# EAGLE schematic 19260 (EAGLE 7.6.0)

## Sheet 1 of 2
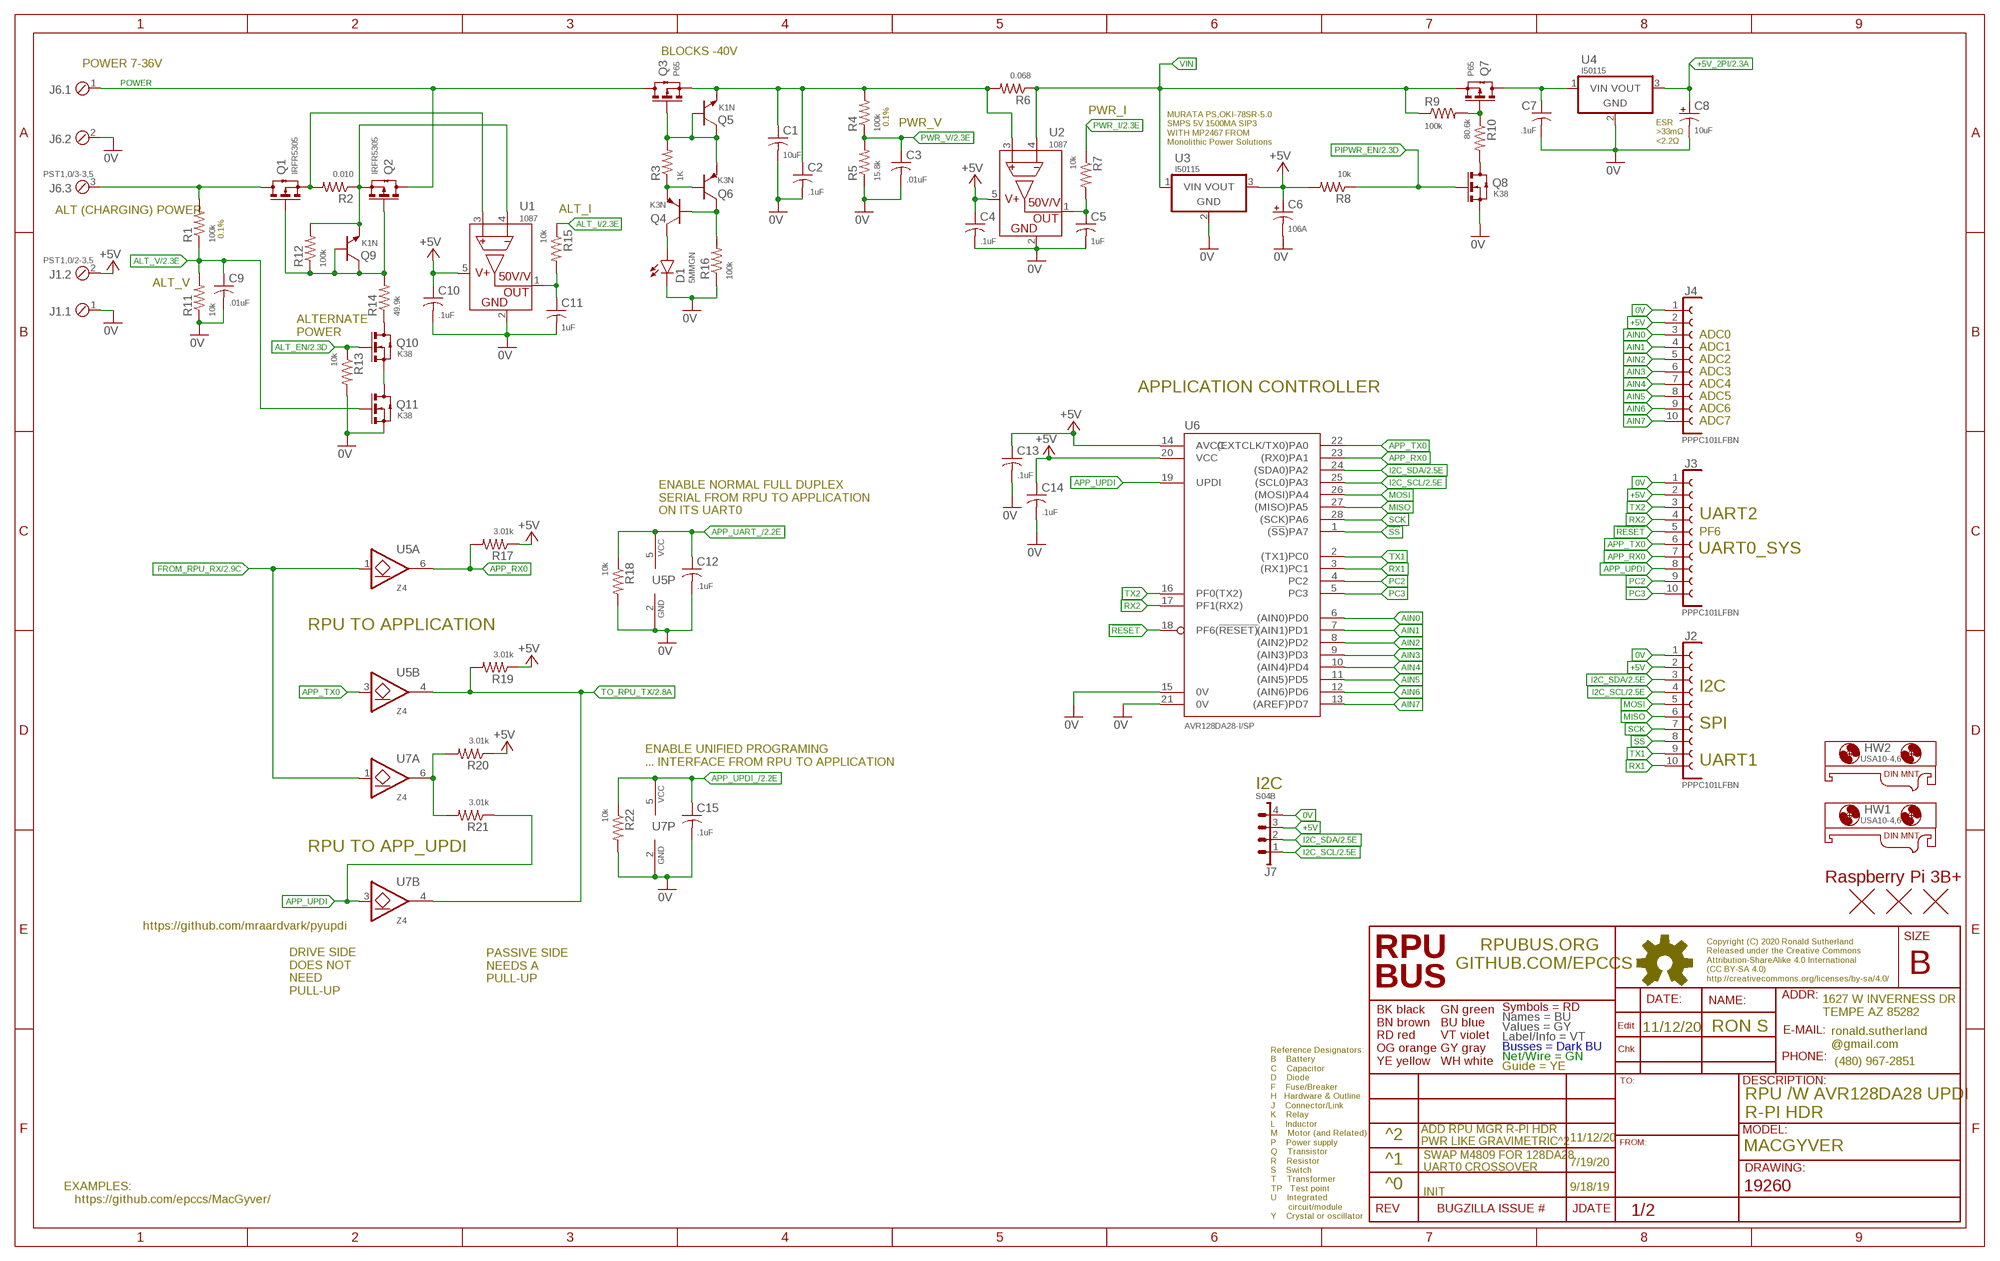
[diagram p0: schematic, sheet 1]

### Parts
C1  10uF  CC1206  [C1206(3216)]
C2  .1uF  CC0805A  [C0805(2012)]
C3  .01uF  CC0603A  [C0603(1608)]
C4  .1uF  CC0603A  [C0603(1608)]
C5  1uF  CC0805A  [C0805(2012)]
C6  106A  CT1206  [3216]
C7  .1uF  CC0603A  [C0603(1608)]
C8  10uF  CT1206  [3216]
C9  .01uF  CC0603A  [C0603(1608)]
C10  .1uF  CC0603A  [C0603(1608)]
C11  1uF  CC0805A  [C0805(2012)]
C12  .1uF  CC0603A  [C0603(1608)]
C13  .1uF  CC0603A  [C0603(1608)]
C14  .1uF  CC0603A  [C0603(1608)]
C15  .1uF  CC0603A  [C0603(1608)]
D1  5MMGN  LED5MM  [LED5MM]
HW1  USA10-4,6  MOUNT-HOLE5.0  [USA10]
HW2  USA10-4,6  MOUNT-HOLE5.0  [USA10]
J1  PST1,0/2-3,5  MCV2  [MCV2]
J2  PPPC101LFBN  F1X10  [F1X10]
J3  PPPC101LFBN  F1X10  [F1X10]
J4  PPPC101LFBN  F1X10  [F1X10]
J6  PST1,0/3-3,5  MCV3  [MCV3]
J7  S04B  B04B  [B04B]
Q1  IRFR5305  N-CHDPAK  [DPAK]
Q2  IRFR5305  N-CHDPAK  [DPAK]
Q3  P65  N-CHSOT23  [SOT23]
Q4  K3N  PNPSOT23  [SOT23]
Q5  K1N  NPNSOT23  [SOT23]
Q6  K3N  PNPSOT23  [SOT23]
Q7  P65  N-CHSOT23  [SOT23]
Q8  K38  N-CHSOT23  [SOT23]
Q9  K1N  NPNSOT23  [SOT23]
Q10  K38  N-CHSOT23  [SOT23]
Q11  K38  N-CHSOT23  [SOT23]
R1  100k  R0805  [C0805(2012)]
R2  0.010  R1210  [C1210(3225)]
R3  1K  R0805  [C0805(2012)]
R4  100k  R0805  [C0805(2012)]
R5  15.8k  R0805  [C0805(2012)]
R6  0.068  R1210  [C1210(3225)]
R7  10k  R0805  [C0805(2012)]
R8  10k  R0805  [C0805(2012)]
R9  100k  R0805  [C0805(2012)]
R10  80.6k  R0805  [C0805(2012)]
R11  10k  R0805  [C0805(2012)]
R12  100k  R0805  [C0805(2012)]
R13  10k  R0805  [C0805(2012)]
R14  49.9k  R0805  [C0805(2012)]
R15  10k  R0805  [C0805(2012)]
R16  100k  R0805  [C0805(2012)]
R17  3.01k  R0805  [C0805(2012)]
R18  10k  R0805  [C0805(2012)]
R19  3.01k  R0805  [C0805(2012)]
R20  3.01k  R0805  [C0805(2012)]
R21  3.01k  R0805  [C0805(2012)]
R22  10k  R0805  [C0805(2012)]
U1  1087  ZXCT1087  [SOT23-5]
U2  1087  ZXCT1087  [SOT23-5]
U3  I50115  OKI-78SR-H  [OKI-78SR-H]
U4  I50115  OKI-78SR-H  [OKI-78SR-H]
U5  Z4  2G07SOT26  [SOT23-6,SOT26]
U6  AVR128DA28-I/SP  [DIL28-3]
U7  Z4  2G07SOT26  [SOT23-6,SOT26]
U$1  R-PI3B+  [R-PI3B+]
U$2  FIDUCIAL1.27  [FIDUCIAL-1.27]
U$3  FIDUCIAL1.27  [FIDUCIAL-1.27]
U$4  FIDUCIAL1.27  [FIDUCIAL-1.27]

### Nets
0V: C1.2 C2.2 C3.2 C4.2 C5.2 C6.- C7.2 C8.- C9.2 C10.2 C11.2 C12.2 C13.2 C14.2 C15.2 D1.K J1.1 J2.1 J3.1 J4.1 J6.2 J7.4 Q8.2(S)(S) Q11.2(S)(S) R5.1 R11.1 R13.2 R16.1 R18.2 R22.2 U1.2(GND) U2.2(GND) U3.2(GND) U4.2(GND) U5.2(P:GND) U6.15(0V) U6.21(0V) U7.2(P:GND) ; also sheet 2
!RESET: J3.5 U6.18(PF6(!RESET))
!SS: J2.8 U6.1((!SS!)PA7)
+5V: C4.1 C6.+ C10.1 C13.1 C14.1 J1.2 J2.2 J3.2 J4.2 J7.3 R8.2 R17.1 R19.1 R20.1 U1.5(VCC) U2.5(VCC) U3.3(VOUT) U6.14(AVCC) U6.20(VCC) ; also sheet 2
+5V_2PI: C8.+ U4.3(VOUT) ; also sheet 2
AIN0: J4.3 U6.6((AIN0)PD0)
AIN1: J4.4 U6.7((AIN1)PD1)
AIN2: J4.5 U6.8((AIN2)PD2)
AIN3: J4.6 U6.9((AIN3)PD3)
AIN4: J4.7 U6.10((AIN4)PD4)
AIN5: J4.8 U6.11((AIN5)PD5)
AIN6: J4.9 U6.12((AIN6)PD6)
AIN7: J4.10 U6.13((AREF)PD7)
ALT_EN: Q10.1(G)(G) R13.1 ; also sheet 2
ALT_I: R15.1 ; also sheet 2
ALT_V: C9.1 Q11.1(G)(G) R1.1 R11.2 ; also sheet 2
APP_RX0: J3.7 R17.2 U5.6(A:O) U6.23((RX0)PA1)
APP_TX0: J3.6 U5.3(B:I) U6.22((EXTCLK/TX0)PA0)
APP_UART_: C12.1 R18.1 U5.5(P:VCC) ; also sheet 2
APP_UPDI: J3.8 R21.1 U6.19(UPDI) U7.3(B:I)
APP_UPDI_: C15.1 R22.1 U7.5(P:VCC) ; also sheet 2
APP_UPDI_PULLUP: R20.2 R21.2 U7.6(A:O)
FROM_RPU_RX: U5.1(A:I) U7.1(A:I) ; also sheet 2
I2C_SCL: J2.4 J7.1 U6.25((SCL0)PA3) ; also sheet 2
I2C_SDA: J2.3 J7.2 U6.24((SDA0)PA2) ; also sheet 2
MISO: J2.6 U6.27((MISO)PA5)
MOSI: J2.5 U6.26((MOSI)PA4)
N$2: Q7.1(G)(G) R9.2 R10.1
N$4: Q8.3(D)(D) R10.2
N$5: Q4.B Q6.C R16.2
N$6: Q3.1(G)(G) Q5.B Q5.C Q6.E R3.2
N$7: D1.A Q4.C
N$8: C5.1 R7.2 U2.1(OUT)
N$10: Q4.E Q6.B R3.1
N$31: J6.3 Q1.SINK(D) R1.2
N$32: Q2.3(S) Q9.E R2.1 R12.2 U1.4(S-)
N$33: Q1.1(G) Q2.1(G) Q9.B Q9.C R12.1 R14.2
N$34: Q10.3(D)(D) R14.1
N$65: C11.1 R15.2 U1.1(OUT)
N$66: Q1.3(S) R2.2 U1.3(S+)
N$97: Q10.2(S)(S) Q11.3(D)(D)
PC2: J3.9 U6.4(PC2)
PC3: J3.10 U6.5(PC3)
PIPWR_EN: Q8.1(G)(G) R8.1 ; also sheet 2
POWER: J6.1 Q2.SINK(D) Q3.3(D)(D)
PWR_I: R7.1 ; also sheet 2
PWR_V: C3.1 R4.1 R5.2 ; also sheet 2
RX1: J2.10 U6.3((RX1)PC1)
RX2: J3.4 U6.17(PF1(RX2))
SCK: J2.7 U6.28((SCK)PA6)
SHLD_VIN: C7.1 Q7.3(D)(D) U4.1(VIN)
TO_RPU_TX: R19.2 U5.4(B:O) U7.4(B:O) ; also sheet 2
TX1: J2.9 U6.2((TX1)PC0)
TX2: J3.3 U6.16(PF0(TX2))
VIN: Q7.2(S)(S) R6.1 R9.1 U2.4(S-) U3.1(VIN)
VIN_S: C1.1 C2.1 Q3.2(S)(S) Q5.E R4.2 R6.2 U2.3(S+)

### Notes on the sheet
- BLOCKS -40V
- POWER 7-36V
- PWR_I
- 0.1% | PWR_V
- ESR
  >33mΩ
  <2.2Ω
- MURATA PS,OKI-78SR-5.0
  SMPS 5V 1500MA SIP3
  WITH MP2467 FROM 
  Monolithic Power Solutions
- ALT (CHARGING) POWER | ALT_I
- 0.1%
- ALT_V
- ALTERNATE
  POWER
- ADC0
- ADC1
- ADC2
- ADC3
- ADC4
- APPLICATION CONTROLLER
- ADC5
- ADC6
- ADC7
- ENABLE NORMAL FULL DUPLEX 
  SERIAL FROM RPU TO APPLICATION
  ON ITS UART0
- UART2
- PF6
- UART0_SYS
- RPU TO APPLICATION
- I2C
- SPI
- ENABLE UNIFIED PROGRAMING
  ... INTERFACE FROM RPU TO APPLICATION
- UART1
- I2C
- RPU TO APP_UPDI
- https://github.com/mraardvark/pyupdi
- PASSIVE SIDE
  NEEDS A
  PULL-UP
- DRIVE SIDE
  DOES NOT
  NEED 
  PULL-UP
- 11/12/20 | RON S
- RPU /W AVR128DA28 UPDI
  R-PI HDR
- ^2 | 11/12/20
- ADD RPU MGR R-PI HDR
  PWR LIKE GRAVIMETRIC^2
- MACGYVER
- ^1 | 7/19/20
- SWAP M4809 FOR 128DA28
  UART0 CROSSOVER
- ^0 | 9/18/19
- INIT
- EXAMPLES:
     https://github.com/epccs/MacGyver/

## Sheet 2 of 2
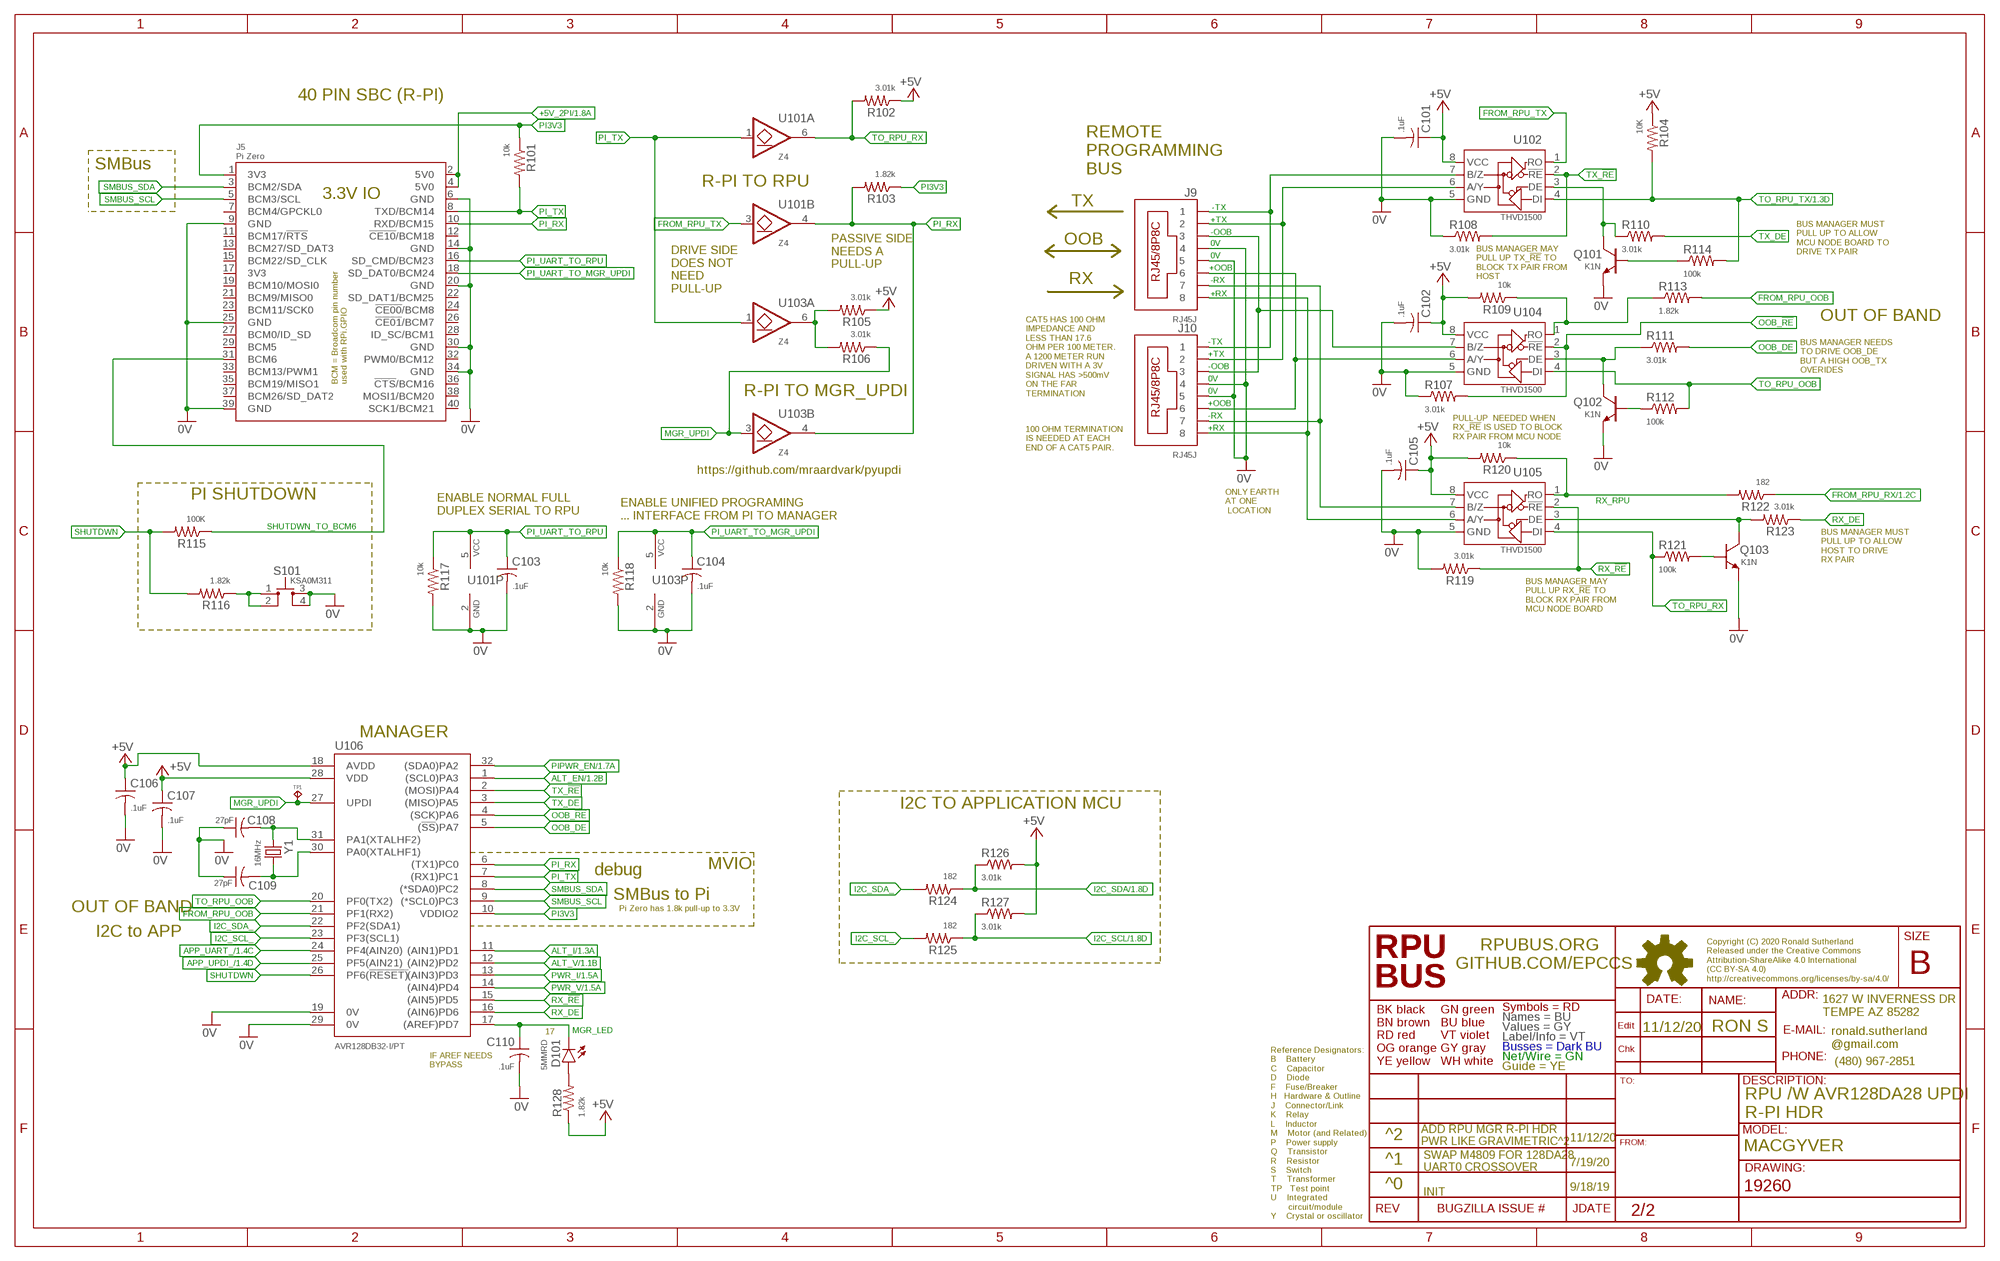
[diagram p1: schematic, sheet 2]

### Parts
C101  .1uF  CC0603A  [C0603(1608)]
C102  .1uF  CC0603A  [C0603(1608)]
C103  .1uF  CC0603A  [C0603(1608)]
C104  .1uF  CC0603A  [C0603(1608)]
C105  .1uF  CC0603A  [C0603(1608)]
C106  .1uF  CC0603A  [C0603(1608)]
C107  .1uF  CC0603A  [C0603(1608)]
C108  27pF  CC0603A  [C0603(1608)]
C109  27pF  CC0603A  [C0603(1608)]
C110  .1uF  CC0603A  [C0603(1608)]
D101  5MMRD  LED5MM  [LED5MM]
J5  Pi Zero  RPI-ZERO90  [RASPI_ZERO_V40PIN]
J9  RJ45J  RJ45-8HZT  [RJ45-8HZT]
J10  RJ45J  RJ45-8HZT  [RJ45-8HZT]
Q101  K1N  NPNSOT23  [SOT23]
Q102  K1N  NPNSOT23  [SOT23]
Q103  K1N  NPNSOT23  [SOT23]
R101  10k  R0805  [C0805(2012)]
R102  3.01k  R0805  [C0805(2012)]
R103  1.82k  R0805  [C0805(2012)]
R104  10K  R0805  [C0805(2012)]
R105  3.01k  R0805  [C0805(2012)]
R106  3.01k  R0805  [C0805(2012)]
R107  3.01k  R0805  [C0805(2012)]
R108  3.01k  R0805  [C0805(2012)]
R109  10k  R0805  [C0805(2012)]
R110  3.01k  R0805  [C0805(2012)]
R111  3.01k  R0805  [C0805(2012)]
R112  100k  R0805  [C0805(2012)]
R113  1.82k  R0805  [C0805(2012)]
R114  100k  R0805  [C0805(2012)]
R115  100K  R0805  [C0805(2012)]
R116  1.82k  R0805  [C0805(2012)]
R117  10k  R0805  [C0805(2012)]
R118  10k  R0805  [C0805(2012)]
R119  3.01k  R0805  [C0805(2012)]
R120  10k  R0805  [C0805(2012)]
R121  100k  R0805  [C0805(2012)]
R122  182  R0805  [C0805(2012)]
R123  3.01k  R0805  [C0805(2012)]
R124  182  R0805  [C0805(2012)]
R125  182  R0805  [C0805(2012)]
R126  3.01k  R0805  [C0805(2012)]
R127  3.01k  R0805  [C0805(2012)]
R128  1.82k  R0805  [C0805(2012)]
S101  KSA0M311  [0M311]
TP1  TPPAD1-08  [P1-08]
U101  Z4  2G07SOT26  [SOT23-6,SOT26]
U102  THVD1500  ISL3172EIBZ  [SOIC8]
U103  Z4  2G07SOT26  [SOT23-6,SOT26]
U104  THVD1500  ISL3172EIBZ  [SOIC8]
U105  THVD1500  ISL3172EIBZ  [SOIC8]
U106  AVR128DB32-I/PT  AVR128DB32  [TQFP32-08]
Y1  16MHz  CSM-3X  [CSM-3X]

### Nets
0V: C101.2 C102.2 C103.2 C104.2 C105.2 C106.2 C107.2 C108.1 C109.1 C110.2 J5.6(GND) J5.9(GND) J5.14(GND) J5.20(GND) J5.25(GND) J5.30(GND) J5.34(GND) J5.39(GND) J9.4 J9.5 J10.4 J10.5 Q101.E Q102.E Q103.E R107.1 R108.1 R117.2 R118.2 R119.2 S101.3 S101.4 U101.2(P:GND) U102.5(GND) U103.2(P:GND) U104.5(GND) U105.5(GND) U106.19(0V) U106.29(0V) ; also sheet 1
+5V: C101.1 C102.1 C105.1 C106.1 C107.1 R102.1 R104.1 R105.1 R109.2 R120.2 R126.2 R127.2 R128.1 U102.8(VCC) U104.8(VCC) U105.8(VCC) U106.18(AVDD) U106.28(VDD) ; also sheet 1
+5V_2PI: J5.2(5V0) J5.4(5V0) ; also sheet 1
+OOB: J9.6 J10.6 U104.6(A/Y)
+RX: J9.8 J10.8 U105.6(A/Y)
+TX: J9.2 J10.2 U102.6(A/Y)
-OOB: J9.3 J10.3 U104.7(B/Z)
-RX: J9.7 J10.7 U105.7(B/Z)
-TX: J9.1 J10.1 U102.7(B/Z)
ALT_EN: U106.1((SCL0)PA3) ; also sheet 1
ALT_I: U106.11((AIN1)PD1) ; also sheet 1
ALT_V: U106.12((AIN2)PD2) ; also sheet 1
APP_UART_: U106.24(PF4(AIN20)) ; also sheet 1
APP_UPDI_: U106.25(PF5(AIN21)) ; also sheet 1
FROM_RPU_OOB: R113.2 U106.21(PF1(RX2))
FROM_RPU_RX: R122.1 ; also sheet 1
FROM_RPU_TX: U101.3(B:I) U102.1(RO)
I2C_SCL: R125.1 R127.1 ; also sheet 1
I2C_SCL_: R125.2 U106.23(PF3(SCL1))
I2C_SDA: R124.1 R126.1 ; also sheet 1
I2C_SDA_: R124.2 U106.22(PF2(SDA1))
MGR_LED: C110.1 D101.K U106.17((AREF)PD7)
MGR_UPDI: R106.1 TP1.TP U103.3(B:I) U106.27(UPDI)
MGR_UPDI_PULLUP: R105.2 R106.2 U103.6(A:O)
N$9: C108.2 U106.31(PA1(XTALHF2)) Y1.1
N$11: C109.2 U106.30(PA0(XTALHF1)) Y1.2
N$79: Q101.B R114.1
N$81: Q101.C R110.1 U102.3(DE)
N$82: R109.1 R113.1 U104.1(RO)
N$83: Q102.C R111.1 U104.3(DE)
N$84: Q102.B R112.1
N$85: Q103.B R121.2
N$86: D101.A R128.2
N$87: Q103.C R123.2 U105.3(DE)
N$93: R116.1 S101.1 S101.2
OOB_!RE: R107.2 U104.2(!RE) U106.4((SCK)PA6)
OOB_DE: R111.2 U106.5((!SS!)PA7)
PI3V3: J5.1(3V3) R101.1 R103.1 U106.10(VDDIO2)
PI_RX: J5.10(RXD/BCM15) R103.2 U101.4(B:O) U103.4(B:O) U106.6((TX1)PC0)
PI_TX: J5.8(TXD/BCM14) R101.2 U101.1(A:I) U103.1(A:I) U106.7((RX1)PC1)
PI_UART_TO_MGR_UPDI: C104.1 J5.18(SD_DAT0/BCM24) R118.1 U103.5(P:VCC)
PI_UART_TO_RPU: C103.1 J5.16(SD_CMD/BCM23) R117.1 U101.5(P:VCC)
PIPWR_EN: U106.32((SDA0)PA2) ; also sheet 1
PWR_I: U106.13((AIN3)PD3) ; also sheet 1
PWR_V: U106.14((AIN4)PD4) ; also sheet 1
RX_!RE: R119.1 U105.2(!RE) U106.15((AIN5)PD5)
RX_DE: R123.1 U106.16((AIN6)PD6)
RX_RPU: R120.1 R122.2 U105.1(RO)
SHUTDWN: R115.2 R116.2 U106.26(PF6(!RESET))
SHUTDWN_TO_BCM6: J5.31(BCM6) R115.1
SMBUS_SCL: J5.5(BCM3/SCL) U106.9((*SCL0)PC3)
SMBUS_SDA: J5.3(BCM2/SDA) U106.8((*SDA0)PC2)
TO_RPU_OOB: R112.2 U104.4(DI) U106.20(PF0(TX2))
TO_RPU_RX: R102.2 R121.1 U101.6(A:O) U105.4(DI)
TO_RPU_TX: R104.2 R114.2 U102.4(DI) ; also sheet 1
TX_!RE: R108.2 U102.2(!RE) U106.2((MOSI)PA4)
TX_DE: R110.2 U106.3((MISO)PA5)
Unconnected: J5.7(BCM4/GPCKL0) J5.11(BCM17/!RTS!) J5.12(!CE10!/BCM18) J5.13(BCM27/SD_DAT3) J5.15(BCM22/SD_CLK) J5.17(3V3) J5.19(BCM10/MOSI0) J5.21(BCM9/MISO0) J5.22(SD_DAT1/BCM25) J5.23(BCM11/SCK0) J5.24(!CE00!/BCM8) J5.26(!CE01!/BCM7) J5.27(BCM0/ID_SD) J5.28(ID_SC/BCM1) J5.29(BCM5) J5.32(PWM0/BCM12) J5.33(BCM13/PWM1) J5.35(BCM19/MISO1) J5.36(!CTS!/BCM16) J5.37(BCM26/SD_DAT2) J5.38(MOSI1/BCM20) J5.40(SCK1/BCM21)

### Notes on the sheet
- 40 PIN SBC (R-PI)
- SMBus
- REMOTE 
  PROGRAMMING
  BUS
- R-PI TO RPU
- TX
- OOB
- BUS MANAGER MUST
  PULL UP TO ALLOW 
  MCU NODE BOARD TO 
  DRIVE TX PAIR
- PASSIVE SIDE
  NEEDS A
  PULL-UP
- BUS MANAGER MAY
  PULL UP TX_!RE! TO 
  BLOCK TX PAIR FROM 
  HOST
- RX
- DRIVE SIDE
  DOES NOT
  NEED 
  PULL-UP
- OUT OF BAND
- BUS MANAGER NEEDS
  TO DRIVE OOB_DE
  BUT A HIGH OOB_TX
  OVERIDES
- R-PI TO MGR_UPDI
- CAT5 HAS 100 OHM 
  IMPEDANCE AND 
  LESS THAN 17.6 
  OHM PER 100 METER. 
  A 1200 METER RUN
  DRIVEN WITH A 3V 
  SIGNAL HAS >500mV
  ON THE FAR
  TERMINATION
- PULL-UP  NEEDED WHEN 
  RX_!RE! IS USED TO BLOCK 
  RX PAIR FROM MCU NODE
- 100 OHM TERMINATION
  IS NEEDED AT EACH
  END OF A CAT5 PAIR.
- https://github.com/mraardvark/pyupdi
- PI SHUTDOWN
- ONLY EARTH
  AT ONE
   LOCATION
- ENABLE NORMAL FULL
  DUPLEX SERIAL TO RPU
- ENABLE UNIFIED PROGRAMING
  ... INTERFACE FROM PI TO MANAGER
- BUS MANAGER MUST
  PULL UP TO ALLOW 
  HOST TO DRIVE
  RX PAIR
- BUS MANAGER MAY
  PULL UP RX_!RE! TO 
  BLOCK RX PAIR FROM
  MCU NODE BOARD
- MANAGER
- I2C TO APPLICATION MCU
- MVIO
- debug
- SMBus to Pi
- OUT OF BAND | Pi Zero has 1.8k pull-up to 3.3V
- I2C to APP
- 17 | 11/12/20 | RON S
- IF AREF NEEDS
  BYPASS
- RPU /W AVR128DA28 UPDI
  R-PI HDR
- ^2 | 11/12/20
- ADD RPU MGR R-PI HDR
  PWR LIKE GRAVIMETRIC^2
- MACGYVER
- ^1 | 7/19/20
- SWAP M4809 FOR 128DA28
  UART0 CROSSOVER
- ^0 | 9/18/19
- INIT

## Library data of the parts
C1-C5 C7 C9-C15 C101-C110 = C-C:C: CAPACITOR Symbol
C6 C8 = C-T:CT: Tantalum Electrolytic Capacitor
D1 D101 = D-LED:LED: LED 120120WH [CREE,XHGAWT-00-0000-00000HXE1] LED WHITE 6500K 150LUM-W120120
HW1 HW2 = HW-DINMnt:MOUNT-HOLE: USA10-4.6 [PhxCont,1202713] DINRAIL ADAPTER UNIVERSAL 10MM 4.6MM
J1 = J-HDR3.5mm:MCV2: MCV 1,5/ 2-G-3,5-RN [PHOENIX CONTACT,1731471] CONN HEADER SHROUDED 2POS 3.5MM MCVR 1,5/ 2-ST-3,5 [PHOENIX CONTACT,1863152] CONN PLUG 2POS SCREW 3.5MM PST 1,0/2-3,5 [PHOENIX CONTACT,1945096] CONN HEADER STRIP PIN 2POS 3.5MM PT1,5/2-PVH-3,5 [PHOENIX CONTACT,1984015] CONN PLUG STRIP 2POS 3.5MM
J2-J4 = J-HDR2.54mm:F1X10: FEMALE HEADER 10POS
J5 = U-Pi:RPI-ZERO: Raspberry Pi Zero https://pinout.xyz/ NOTE: WiFi is needed see https://www.kickstarter.com/projects/1991736672/iot-hat-for-raspberry-pi-a-must-have-for-pi-zero
J6 = J-HDR3.5mm:MCV3: MCV 1,5/ 3-G-3,5-RN [PHOENIX CONTACT,1731484] CONN HEADER SHROUDED 3POS 3.5MM MCVR 1,5/ 3-ST-3,5 [PHOENIX CONTACT,1863165] CONN PLUG 3POS SCREW 3.5MM PST 1,0/3-3,5 [PHOENIX CONTACT,1945106] CONN HEADER STRIP PIN 3POS 3.5MM PT1,5&3-PVH-3,5 [PHOENIX CONTACT,1984028] CONN PLUG STRIP 3POS 3.5MM
J7 = J-HDR2mm:B04B: B04B [JST@B04B-PASK] CONN HEADER VERT THRU 4POS S04B [JST@S04B-PASK] CONN HEADER SIDE THRU 4POS
J9 J10 = J-RJ45:RJ45-8: RJ45 Jack RJ45J [ASSMANN,A-2014-2-4-R] JACK MODULAR VERT PCB 8P8C UNSHIELD Horz version form sparkfun sku PRT-00643, and breakout board sku is BOB-00716.
Q1-Q3 Q7 = Q-PCH:N-CH?*: ENHANCEMENT MODE MOSFET SOT23 is BSS138 pinout
Q4 Q6 = Q-PNP:PNP: BJT NPN General Purpose Amplifier
Q5 Q9 Q101-Q103 = Q-NPN:NPN: BJT NPN General Purpose Amplifier
Q8 Q10 Q11 = Q-NCH:N-CH?*: ENHANCEMENT MODE MOSFET SOT23 is BSS138 pinout
R1-R22 R101-R128 = R-C:R: Resiistor American-style symbol
S101 = S-Tactile:KSA: KSA0M311 [C&K,KSA0M311LFT] SWITCH TACTILE SEALED SPST-NO 50MA 32V
TP1 = J-TP:TP: Test pad
U1 U2 = U-Linear:ZXCT1087: 1087 [DIODES,ZXCT1087E5TA] HISIDE CURRENT MONITOR SOT23-5
U3 U4 = P-DCDC:OKI-78SR: OKI-78SR OKI-78SR-5/1.5-W36H-C 5V@1.5A Horizontal Mount OKI-78SR-5/1.5-W36-C 5V@1.5A Vert Mount OKI-78SR-3.3/1.5-W36H-C 3.3V@1.5A Horizontal Mount OKI-78SR-3.3/1.5-W36-C 3.3V@1.5A Vert Mount Murata Power Solutions 7 to 36 VDC input range need to verify pinout
U5 U7 U101 U103 = U-7400:2G07: BUFFER OPEN DRAIN Z4 [DIODES,74LVC2G07W6-7] LOGIC BUFFER OPEN DRAIN SOT26
U6 = U-AVR:AVR128DA28: AVR128DA28-I/[SO | SP] IC MCU 8BIT 128kB FLASH 16kB SRAM SP = SPDIP 28 PIN SO = SOIC 28 PIN
U102 U104 U105 = U-Transceiver:ISL3172E: TRANSCEIVER RS485 3.3V HALFDPLX
U106 = U-AVR:AVR128DB32: AVR128DB32-I/[RXB | PT] IC MCU 8BIT 128kB FLASH 16kB SRAM PT = TQFP 32 PIN RXB = VQFN 32 PIN
U$1 = J-BoardHDR:R-PI3B+
U$2-U$4 = H-Fiducial:FIDUCIAL: Fiducial Alignment Points Various fiducial points for machine vision alignment.
Y1 = Y-XTL:CSM: 16MHZ20 [ECS,ECS-160-20-3X-TR] CRYSTAL 16MHZ 20PF 30PPM CSM-3X

## Net classes
0 default: width 0.178 mm, drill 0.33 mm